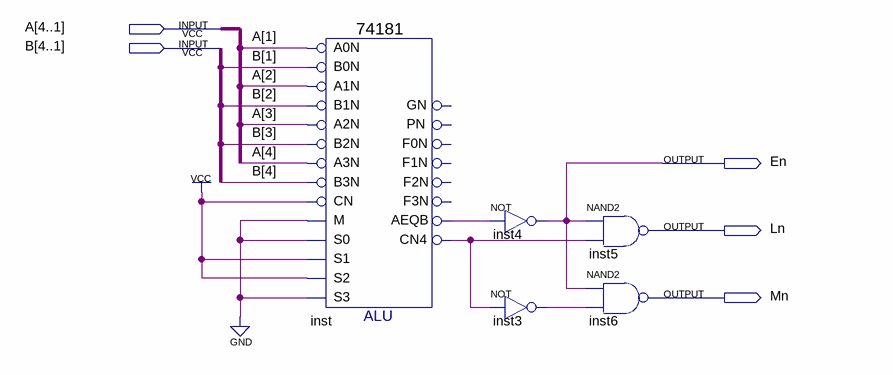
[diagram p0: schematic sheet]
// Quartus schematic alu_compbdf.bdf as structural Verilog: 5 symbols, 5 pins
module alu_compbdf (
  input  [4:1] A,
  input  [4:1] B,
  output En,
  output Ln,
  output Mn
);

  wire inst3_out, inst_aeqb, inst_cn4;

  \74181  inst (
    .B0N(B[1]), .A0N(A[1]), .A1N(A[2]), .B1N(B[2]), .A3N(A[4]), .B2N(B[3]), .A2N(A[3]), .M(1'b0), .CN(1'b1),
    .B3N(B[4]), .S2(1'b1), .S1(1'b1), .S0(1'b0), .S3(1'b0), .AEQB(inst_aeqb), .CN4(inst_cn4));  // open: PN, GN, F3N, F1N, F0N, F2N
  not inst4 (En, inst_aeqb);
  not inst3 (inst3_out, inst_cn4);
  nand inst5 (Ln, En, inst_cn4);
  nand inst6 (Mn, En, inst3_out);
endmodule
